# EAGLE design ButtonMatrix (EAGLE 7.6.0)
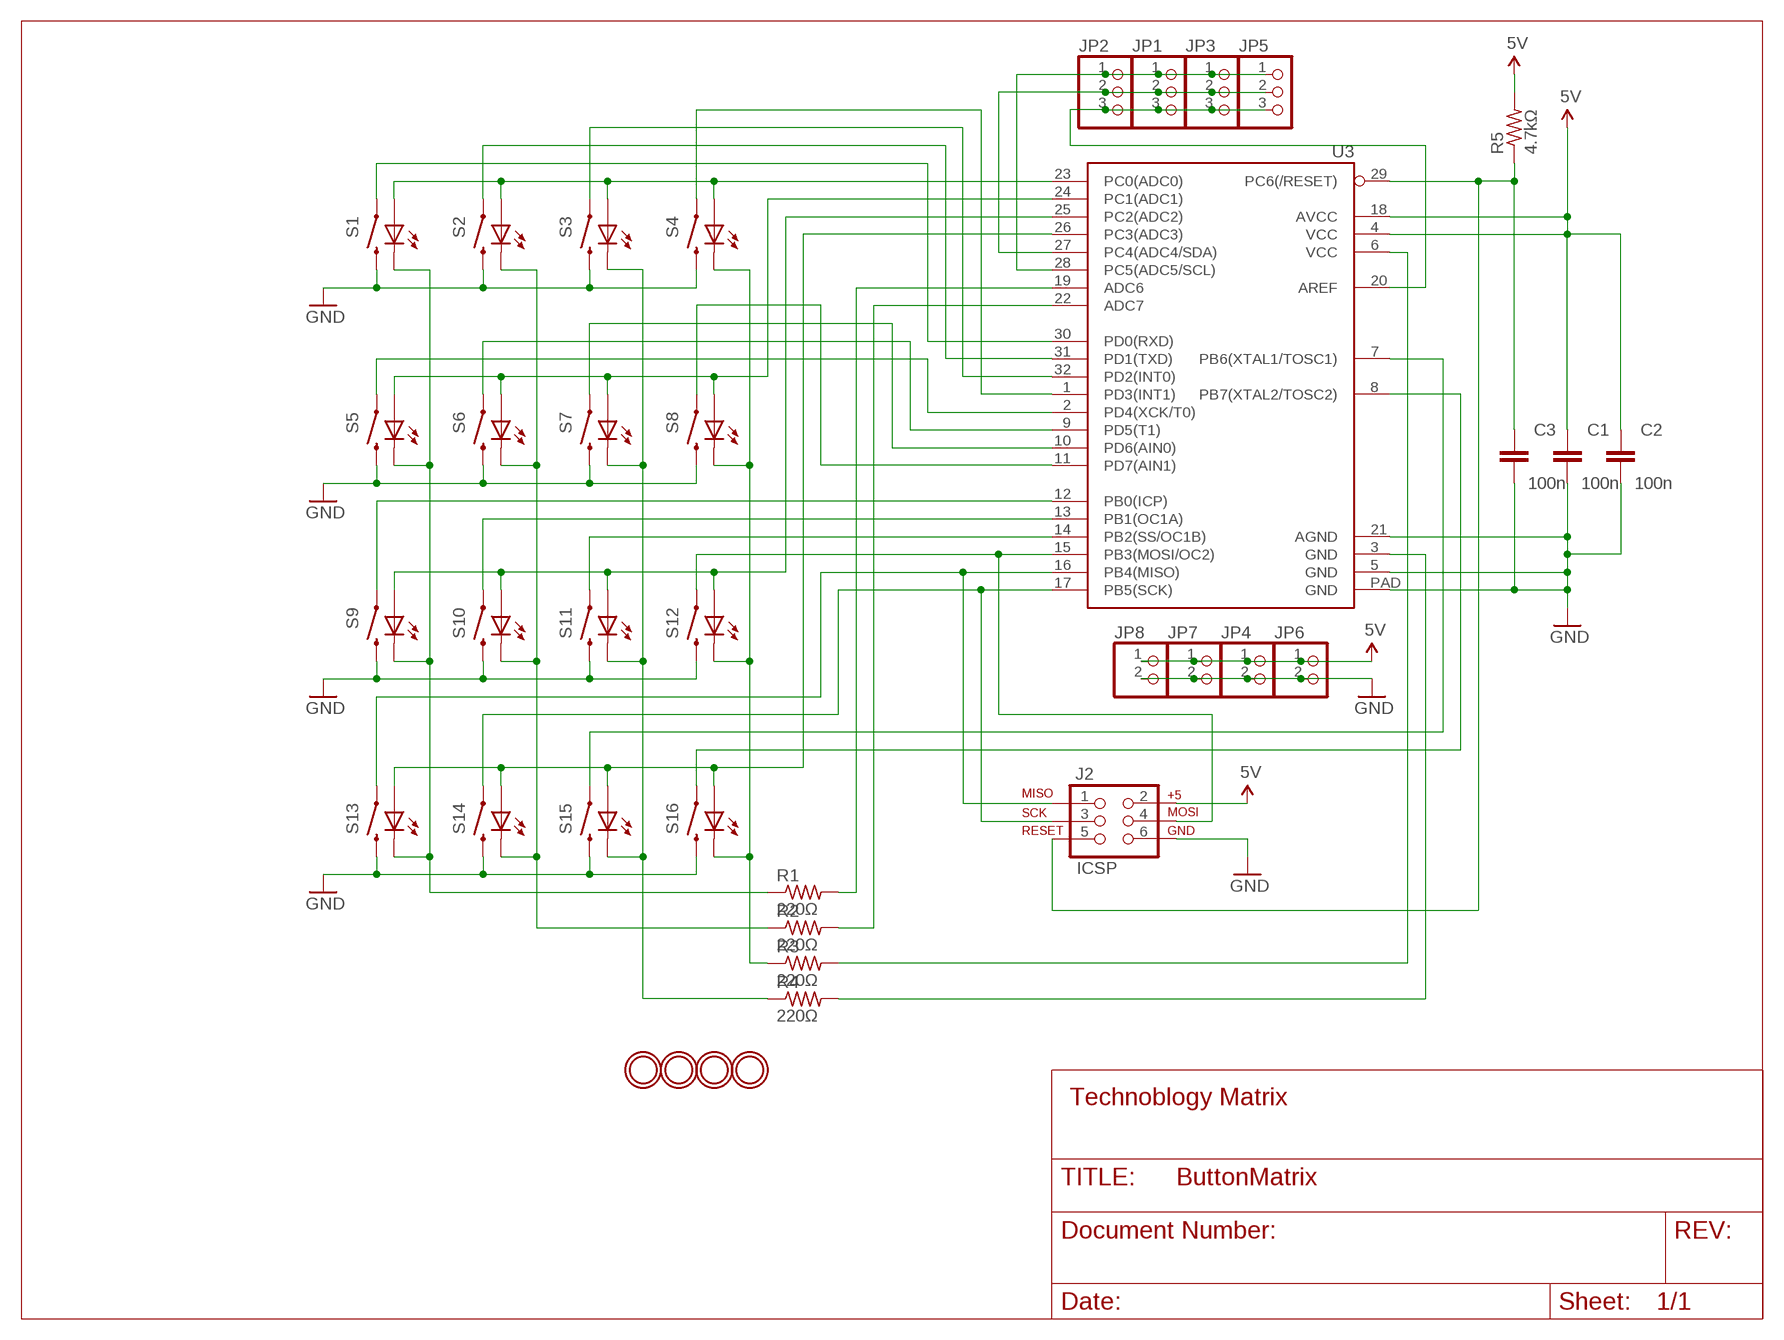
[diagram p0: schematic, sheet 1]

## Parts
C1  100n  CAP0603-CAP  [0603-CAP]
C2  100n  CAP0603-CAP  [0603-CAP]
C3  100n  CAP0603-CAP  [0603-CAP]
J2  ICSP  AVR_SPI_PRG_6PTH  [2X3]
JP1  HEADER-1X3EDGESMT  [1X03_EDGESMT]
JP2  HEADER-1X3EDGESMT  [1X03_EDGESMT]
JP3  HEADER-1X3EDGESMT  [1X03_EDGESMT]
JP4  HEADER-1X2EDGE  [1X02_EDGESMT]
JP5  HEADER-1X3EDGESMT  [1X03_EDGESMT]
JP6  HEADER-1X2EDGE  [1X02_EDGESMT]
JP7  HEADER-1X2EDGE  [1X02_EDGESMT]
JP8  HEADER-1X2EDGE  [1X02_EDGESMT]
R1  220Ω  R-US_R0805  [R0805]
R2  220Ω  R-US_R0805  [R0805]
R3  220Ω  R-US_R0805  [R0805]
R4  220Ω  R-US_R0805  [R0805]
R5  4.7kΩ  R-US_R0805  [R0805]
S1  SWITCH-MOMENTARY-LEDPTH  [TACTILE-PTH-LED-12MM]
S2  SWITCH-MOMENTARY-LEDPTH  [TACTILE-PTH-LED-12MM]
S3  SWITCH-MOMENTARY-LEDPTH  [TACTILE-PTH-LED-12MM]
S4  SWITCH-MOMENTARY-LEDPTH  [TACTILE-PTH-LED-12MM]
S5  SWITCH-MOMENTARY-LEDPTH  [TACTILE-PTH-LED-12MM]
S6  SWITCH-MOMENTARY-LEDPTH  [TACTILE-PTH-LED-12MM]
S7  SWITCH-MOMENTARY-LEDPTH  [TACTILE-PTH-LED-12MM]
S8  SWITCH-MOMENTARY-LEDPTH  [TACTILE-PTH-LED-12MM]
S9  SWITCH-MOMENTARY-LEDPTH  [TACTILE-PTH-LED-12MM]
S10  SWITCH-MOMENTARY-LEDPTH  [TACTILE-PTH-LED-12MM]
S11  SWITCH-MOMENTARY-LEDPTH  [TACTILE-PTH-LED-12MM]
S12  SWITCH-MOMENTARY-LEDPTH  [TACTILE-PTH-LED-12MM]
S13  SWITCH-MOMENTARY-LEDPTH  [TACTILE-PTH-LED-12MM]
S14  SWITCH-MOMENTARY-LEDPTH  [TACTILE-PTH-LED-12MM]
S15  SWITCH-MOMENTARY-LEDPTH  [TACTILE-PTH-LED-12MM]
S16  SWITCH-MOMENTARY-LEDPTH  [TACTILE-PTH-LED-12MM]
U3  ATMEGA328P_MLFMLF32  [MLF32-PAD]
U$1  MOUNTINGHOLE2.5  [MOUNTINGHOLE_2.5_PLATED]
U$2  MOUNTINGHOLE2.5  [MOUNTINGHOLE_2.5_PLATED]
U$3  MOUNTINGHOLE2.5  [MOUNTINGHOLE_2.5_PLATED]
U$4  MOUNTINGHOLE2.5  [MOUNTINGHOLE_2.5_PLATED]

## Nets
5V: C1.1 C2.1 J2.2 JP4.1 JP6.1 JP7.1 JP8.1 R5.2 U3.4(VCC) U3.18(AVCC)
GND: C1.2 C2.2 C3.2 J2.6 JP4.2 JP6.2 JP7.2 JP8.2 S1.2 S2.2 S3.2 S4.2 S5.2 S6.2 S7.2 S8.2 S9.2 S10.2 S11.2 S12.2 S13.2 S14.2 S15.2 S16.2 U3.5(GND) U3.21(AGND) U3.PAD(GND)
N$2: S9.A S10.A S11.A S12.A U3.25(PC2(ADC2))
N$5: R1.1 S1.C S5.C S9.C S13.C
N$6: R2.1 S2.C S6.C S10.C S14.C
N$7: R3.2 U3.6(VCC)
N$8: S1.4 U3.30(PD0(RXD))
N$9: R3.1 S4.C S8.C S12.C S16.C
N$10: S2.4 U3.31(PD1(TXD))
N$11: S3.4 U3.32(PD2(INT0))
N$12: S4.4 U3.1(PD3(INT1))
N$13: S5.4 U3.2(PD4(XCK/T0))
N$14: S6.4 U3.9(PD5(T1))
N$15: S7.4 U3.10(PD6(AIN0))
N$16: S8.4 U3.11(PD7(AIN1))
N$17: S9.4 U3.12(PB0(ICP))
N$18: S10.4 U3.13(PB1(OC1A))
N$19: S11.4 U3.14(PB2(SS/OC1B))
N$20: J2.4 S12.4 U3.15(PB3(MOSI/OC2))
N$21: J2.1 S13.4 U3.16(PB4(MISO))
N$22: J2.3 S14.4 U3.17(PB5(SCK))
N$23: S15.4 U3.7(PB6(XTAL1/TOSC1))
N$24: S16.4 U3.8(PB7(XTAL2/TOSC2))
N$25: S1.A S2.A S3.A S4.A U3.23(PC0(ADC0))
N$27: S5.A S6.A S7.A S8.A U3.24(PC1(ADC1))
N$28: S13.A S14.A S15.A S16.A U3.26(PC3(ADC3))
N$29: JP1.2 JP2.2 JP3.2 JP5.2 U3.27(PC4(ADC4/SDA))
N$30: JP1.1 JP2.1 JP3.1 JP5.1 U3.28(PC5(ADC5/SCL))
N$31: JP1.3 JP2.3 JP3.3 JP5.3 U3.20(AREF)
N$32: R2.2 U3.22(ADC7)
N$33: R1.2 U3.19(ADC6)
N$34: C3.1 J2.5 R5.1 U3.29(PC6(/RESET))
N$35: R4.2 U3.3(GND)
N$36: R4.1 S3.C S7.C S11.C S15.C

## Notes on the sheet
- Technoblogy Matrix

## Library data of the parts
C1-C3 = SparkFun-Capacitors:CAP: Capacitor Standard 0603 ceramic capacitor, and 0.1" leaded capacitor.
J2 = SparkFun:AVR_SPI_PRG_6: AVR ISP 6 Pin This is the reduced ISP connector for AVR programming. Common on Arduino. This footprint will take up less PCB space and can be used with a 10-pin to 6-pin adapter such as SKU: BOB-08508
JP1-JP3 JP5 = microbuilder:HEADER-1X3: PIN HEADER
JP4 JP6-JP8 = microbuilder:HEADER-1X2: PIN HEADER
R1-R5 = adafruit:R-US_: RESISTOR, American symbol
S1-S16 = SparkFun-Electromechanical:SWITCH-MOMENTARY-LED: EZ is for Kits. There is no tStop (covering up the top side of the pads with mask). This helps the beginner see which side they should be soldering too.
U3 = SparkFun-DigitalIC:ATMEGA328P_MLF: 32-Pin Atmega328 part Commonly used on Arduino compatible boards Available in QFP and QFN packages TQFP is IC-09069 QFN is non-stock
U$1-U$4 = microbuilder:MOUNTINGHOLE: Mounting Hole For #2 screws (0.086"/2.18mm width, 0.094"/2.4mm hole) use 2.5mm; BOM: EXCLUDE

## Board
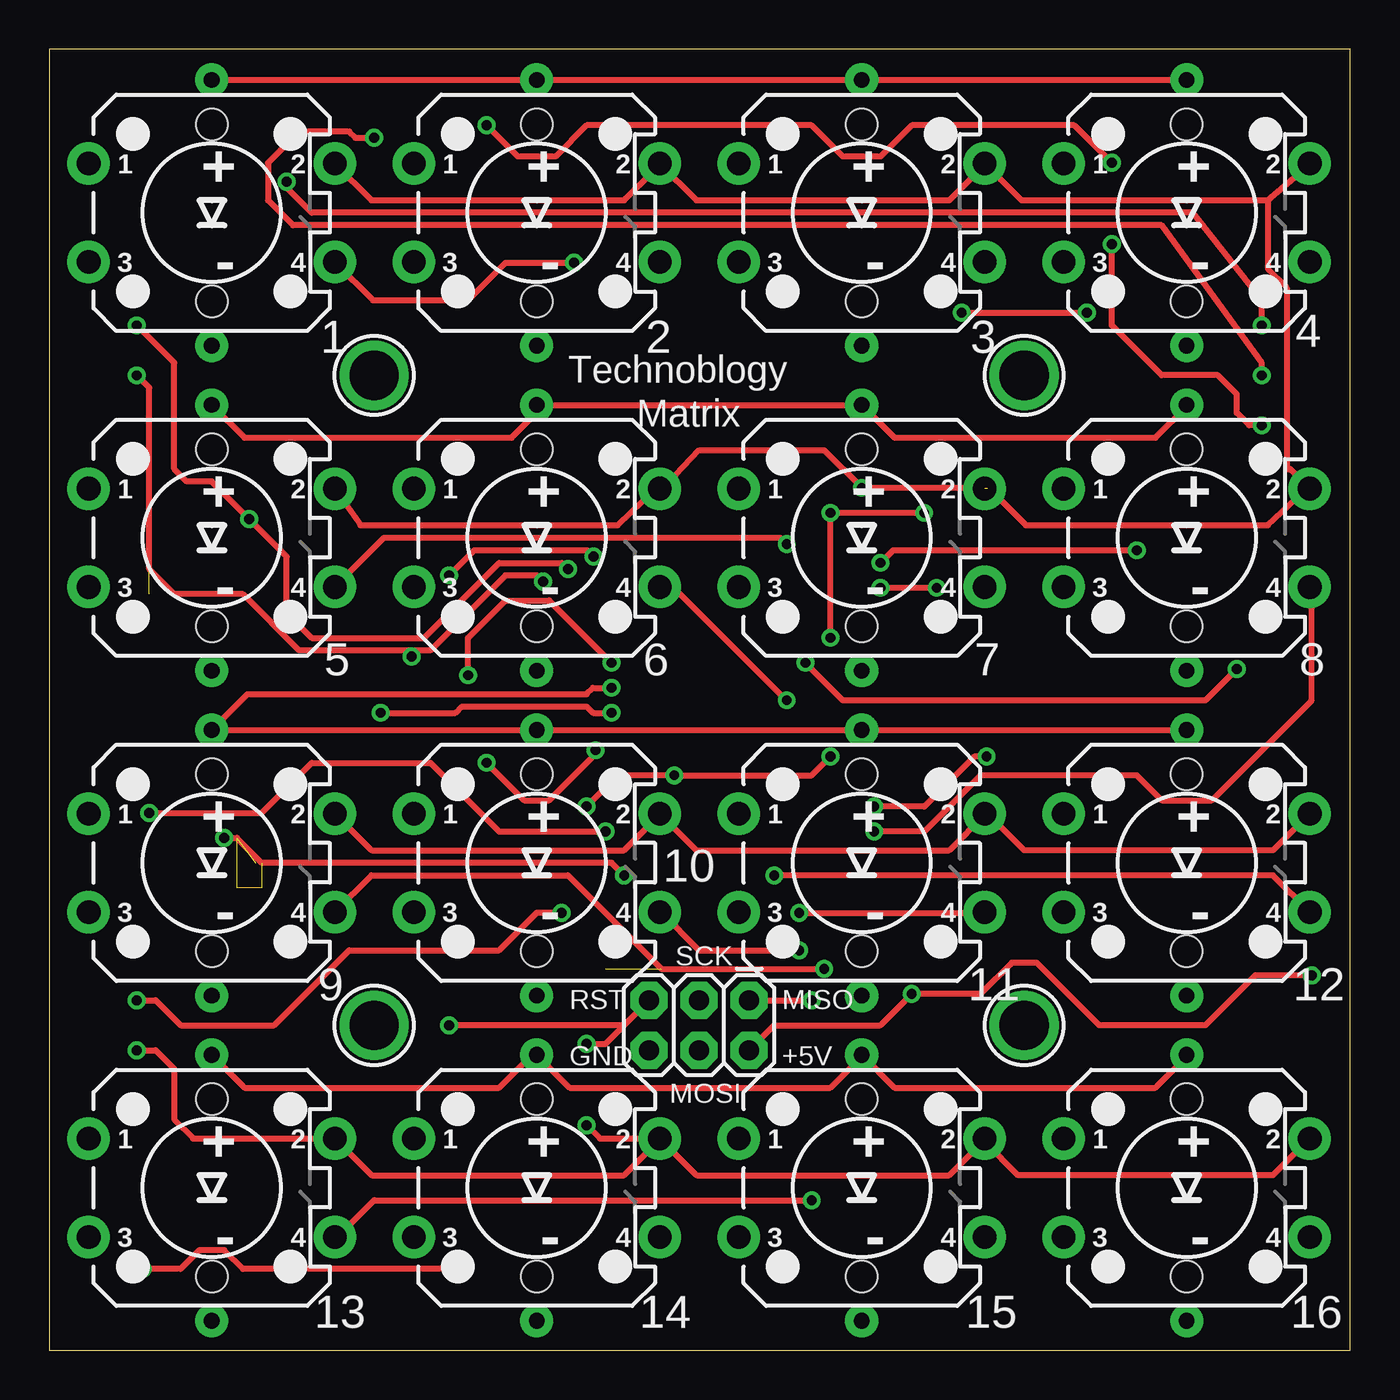
[diagram p1: board, top side]
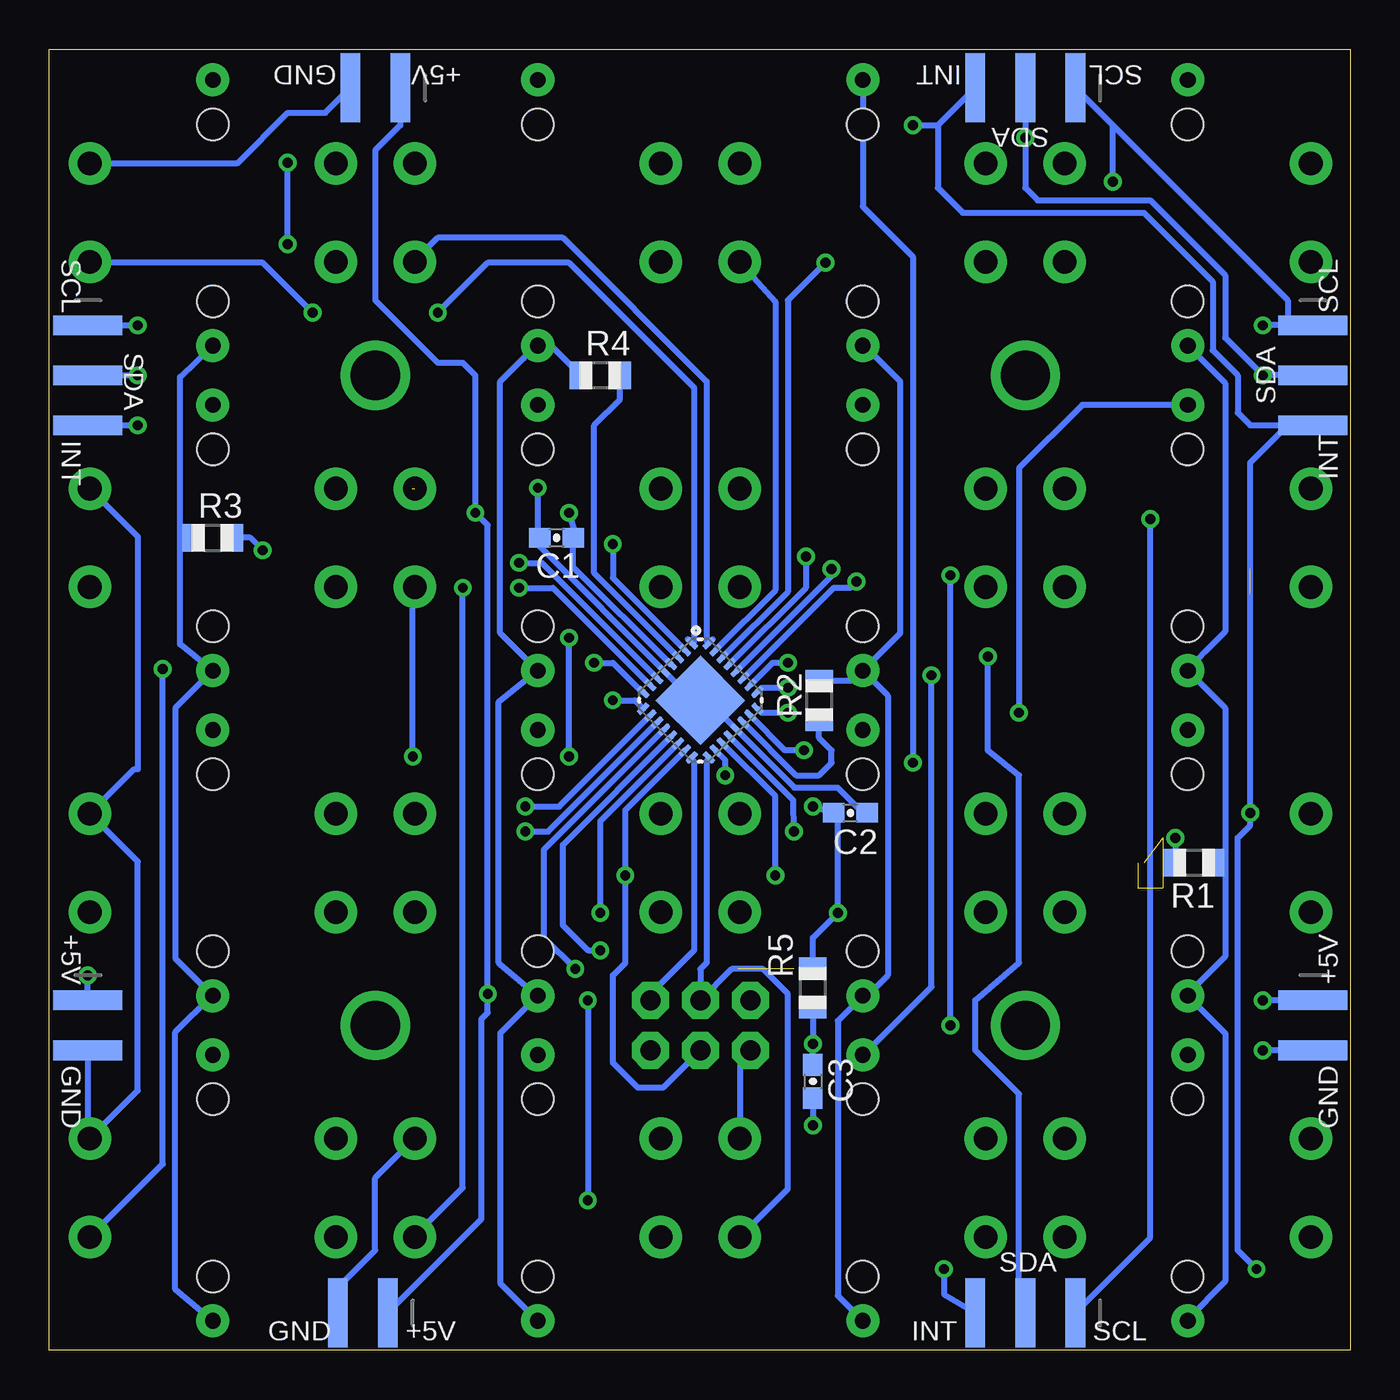
[diagram p2: board, bottom side, seen from below]

Size 66.1 x 66.1 mm. Coordinates in mm from the lower left corner, seen from the top.
Outline: 0,0 66.1,0 66.1,66.1 0,66.1 0,0
Copper layers (1*16): Top 0.035mm / dielectric 1.5mm / Bottom 0.035mm
Design rules "adafruit *": minimum track width 8mil, minimum drill 15.5mil, track to track 6mil, track to pad 6mil, pad to pad 6mil, via to via 6mil, smd to smd 6mil, copper to edge 10mil, drill to drill 8mil, minimum pad ring 10mil, minimum via ring 8mil, stop-mask expansion 4mil, vias tented up to drill 20mil, thermal gap 10mil

### Footprints (pad centres in the part's own frame; a part is rotated, then mirrored left to right if it is on the bottom)
0603-CAP = smd 1.1 x 1: 1 -0.85,0; 2 0.85,0
2X3 = drill 1.016 pad 1.88 octagon: 1 0,0; 2 0,2.54; 3 2.54,0; 4 2.54,2.54; 5 5.08,0; 6 5.08,2.54
1X03_EDGESMT = smd 1 x 3.5: 1 -2.54,0; 2 0,0; 3 2.54,0
1X02_EDGESMT = smd 1 x 3.5: 1 -1.27,0; 2 1.27,0
R0805 = smd 1.1 x 1.4: 1 -1,0; 2 1,0
TACTILE-PTH-LED-12MM = drill 1.2 pad 2.159: 1 -6.25,2.5; 2 6.25,2.5; 3 -6.25,-2.5; 4 6.25,-2.5 | drill 0.8 pad 1.676: A 0,6.75; C 0,-6.75 | hole 1.6: 0,4.5; 0,-4.5
MLF32-PAD = smd 0.7 x 0.3: 1 -2.35,1.75; 2 -2.35,1.25; 3 -2.35,0.75; 4 -2.35,0.25; 5 -2.35,-0.25; 6 -2.35,-0.75; 7 -2.35,-1.25; 8 -2.35,-1.75; 17 2.35,-1.75; 18 2.35,-1.25; 19 2.35,-0.75; 20 2.35,-0.25; 21 2.35,0.25; 22 2.35,0.75; 23 2.35,1.25; 24 2.35,1.75 | smd 0.3 x 0.7: 9 -1.75,-2.35; 10 -1.25,-2.35; 11 -0.75,-2.35; 12 -0.25,-2.35; 13 0.25,-2.35; 14 0.75,-2.35; 15 1.25,-2.35; 16 1.75,-2.35; 25 1.75,2.35; 26 1.25,2.35; 27 0.75,2.35; 28 0.25,2.35; 29 -0.25,2.35; 30 -0.75,2.35; 31 -1.25,2.35; 32 -1.75,2.35 | smd 3.2 x 3.2: PAD 0,0
MOUNTINGHOLE_2.5_PLATED = drill 2.5 pad 3.2: P$1 0,0

### Placement (x,y rotation side)
C1  40.32,41.27 180 bottom
C2  25.4,27.3 0 bottom
C3  27.3,13.65 270 bottom
J2  35.56,17.78 180 top
JP1  64.13,49.53 270 bottom
JP2  1.91,49.53 270 bottom
JP3  16.51,64.13 180 bottom
JP4  1.91,16.51 270 bottom
JP5  16.51,1.91 180 bottom
JP6  64.13,16.51 270 bottom
JP7  50.16,1.91 180 bottom
JP8  49.53,64.13 180 bottom
R1  7.94,24.76 180 bottom
R2  26.99,33.02 270 bottom
R3  57.79,41.27 0 bottom
R4  38.1,49.53 0 bottom
R5  27.3,18.41 90 bottom
S1  8.26,57.79 0 top
S2  24.76,57.79 0 top
S3  41.27,57.79 0 top
S4  57.79,57.79 0 top
S5  8.26,41.27 0 top
S6  24.76,41.27 0 top
S7  41.27,41.27 0 top
S8  57.79,41.27 0 top
S9  8.26,24.76 0 top
S10  24.76,24.76 0 top
S11  41.27,24.76 0 top
S12  57.79,24.76 0 top
S13  8.26,8.26 0 top
S14  24.76,8.26 0 top
S15  41.27,8.26 0 top
S16  57.79,8.26 0 top
U3  33.02,33.02 315 bottom
U$1  16.51,49.53 0 top
U$2  49.53,16.51 0 top
U$3  49.53,49.53 0 top
U$4  16.51,16.51 0 top

### Tracks (layer width: path | path; a pad name or v marks a point on that pad's centre or on a via)
5V  (via drill 0.5)
  Top 0.305: J2.2 36.83,16.51 42.23,16.51 v43.82,18.1 47.31,18.1 48.9,19.68 50.16,19.68 53.34,16.51 58.74,16.51 61.28,19.05 v64.13,19.05 | v44.45,42.55 v39.69,42.55 v39.69,36.2 | v39.69,30.16 38.73,29.21 v31.75,29.21 28.89,29.21 v27.3,27.62 | v4.45,17.78 5.4,17.78 6.67,16.51 11.43,16.51 15.24,20.32 22.86,20.32 24.76,22.22 v26.04,22.22
  Bottom 0.305: U3.4 34.54,34.86 39.47,39.79 C1.1 39.37,41.38 v39.69,42.55 | JP6.1 v64.13,19.05 | JP4.1 v4.45,17.78 | JP7.1 44.13,6.67 44.13,16.83 43.82,17.14 v43.82,18.1 43.82,41.91 v44.45,42.55 44.45,49.53 45.09,50.16 46.36,50.16 49.53,53.34 49.53,60.96 48.26,62.23 JP8.1 | v39.69,30.16 v39.69,36.2 | v31.75,29.21 31.75,29.98 U3.18 | v27.3,27.62 27.2,27.62 C2.1 26.04,27.09 v26.04,22.22 27.3,20.95 R5.2
GND  (via drill 0.5)  (1 unrouted)
  Top 0.305: S9.2 16.37,25.4 29.21,25.4 31.07,27.26 S10.2 32.88,25.4 45.72,25.4 47.59,27.26 | S12.2 62.17,25.4 49.53,25.4 47.66,27.26 47.59,27.26 | 47.59,27.26 S11.2 | S14.2 31.07,10.76 29.21,8.89 16.37,8.89 S13.2 7.3,10.76 6.35,11.71 6.35,14.29 5.4,15.24 v4.45,15.24 | S14.2 32.88,8.89 45.72,8.89 47.52,10.7 S15.2 | S16.2 62.17,8.89 49.21,8.89 47.52,10.58 S15.2 | 31.07,43.77 S6.2 | S1.2 16.37,58.42 29.21,58.42 30.7,59.91 S2.2 32.88,58.42 45.72,58.42 47.52,60.23 S3.2 49.39,58.42 61.91,58.42 | 61.91,58.42 64.09,60.29 S4.2 | 47.48,10.79 S15.2 | S5.2 15.81,41.91 28.89,41.91 30.84,43.77 S6.2 | S6.2 31.01,43.6 33.02,45.72 39.37,45.72 v41.27,43.82 47.48,43.82 S7.2 | 48.34,43.18 49.61,41.91 61.91,41.91 64.03,43.91 S8.2 63.04,44.77 62.87,44.77 62.87,53.98 61.91,54.93 61.91,58.42 | 48.34,43.18 47.75,43.77 47.66,43.77 48.34,43.18 | v27.3,11.43 27.98,10.76 S14.2
  Bottom 0.305: S8.2 61.59,41.34 61.59,29.53 61.77,29.53 S12.2 61.59,24.82 61.59,13.2 S16.2 64.13,10.86 JP6.2 | J2.6 31.01,14.71 S14.2 | JP4.2 v4.45,15.24 | JP7.2 51.44,3.17 49.53,5.08 49.53,8.75 S15.2 | S4.2 56.55,60.29 53.98,62.87 52.07,62.87 JP8.2 | C2.2 24.76,27.3 26.04,28.57 28.26,28.57 28.26,28.61 U3.21 32.67,33.02 U3.PAD 33.37,33.02 U3.5 41.17,40.82 C1.2 41.27,41.38 v41.27,43.82 | C3.2 v27.3,11.43
N$2  (via drill 0.5)
  Top 0.305: v28.57,33.66 27.62,33.66 27.3,33.34 10.08,33.34 S9.A | S9.A S10.A S11.A | S11.A S12.A | 41.27,31.43 S11.A | 9.12,32.39 S9.A
  Bottom 0.305: v28.57,33.66 29.91,33.66 U3.25 | 8.29,31.51 S9.A
N$5
  Bottom 0.305: 6.35,24.76 6.35,32.62 S5.C 7.38,35.48 6.35,36.51 6.35,49.13 S1.C | 6.35,24.76 6.35,20 8.02,18.33 S9.C 6.35,16.11 6.35,3.49 8.26,1.59 S13.C | R1.1 6.35,24.76
N$6
  Bottom 0.305: S14.C 26.04,2.78 26.04,16.74 S10.C 24.53,18.01 23.49,19.05 23.49,33.26 S6.C | S6.C 22.86,36.43 22.86,49.21 24.68,51.04 S2.C | 23.76,35.52 S6.C | R2.1 25.27,34.02 S6.C
N$7  (via drill 0.5)
  Top 0.305: v42.23,40.01 42.86,40.64 v55.25,40.64
  Bottom 0.305: v42.23,40.01 41.07,40.01 U3.6 | v55.25,40.64 55.88,41.27 R3.2
N$8  (via drill 0.5)
  Top 0.305: S1.4 16.45,53.34 21.27,53.34 23.18,55.25 v26.67,55.25
  Bottom 0.305: U3.30 28.57,38.53 28.57,53.34 v26.67,55.25
N$9
  Bottom 0.305: S16.C 59.69,3.09 59.69,16.17 57.84,18.01 S12.C 59.69,19.92 59.69,32.62 S8.C 59.46,35.88 59.46,41.27 | S4.C 59.46,49.45 59.46,41.27 | R3.1 59.46,41.27
N$10
  Bottom 0.305: S2.4 29.21,53.28 29.21,38.6 U3.31
N$11
  Bottom 0.305: 32.39,36.13 U3.32 32.7,36.03 32.7,49.21 40.01,56.52 46.36,56.52 47.52,55.34 S3.4
N$12  (via drill 0.5)
  Top 0.305: v46.36,52.71 v52.71,52.71
  Bottom 0.305: 33.66,36.13 U3.1 33.34,36.03 33.34,48.9 39.69,55.25 43.82,55.25 v46.36,52.71 | v52.71,52.71 55.25,55.25 63.99,55.25 S4.4
N$13  (via drill 0.5)
  Top 0.305: S5.4 17,41.27 37.15,41.27 v37.47,40.96
  Bottom 0.305: v37.47,40.96 37.47,39.23 U3.2
N$14  (via drill 0.5)
  Top 0.305: S6.4 31.65,38.84 v37.47,33.02
  Bottom 0.305: v37.47,33.02 36.34,33.02 U3.9
N$15  (via drill 0.5)
  Top 0.305: v47.62,30.16 46.99,30.16 44.45,27.62 v41.91,27.62
  Bottom 0.305: v41.91,27.62 40.19,27.62 U3.10 | v47.62,30.16 47.62,38.68 S7.4
N$16  (via drill 0.5)
  Top 0.305: v41.91,26.35 44.45,26.35 47.31,29.21 55.25,29.21 56.52,27.94 59.05,27.94 64.13,33.02 64.13,38.68 S8.4
  Bottom 0.305: U3.11 40.75,26.35 v41.91,26.35
N$17  (via drill 0.5)  (1 unrouted)
  Top 0.305: S9.4 16.37,24.13 26.35,24.13 31.11,19.37 v39.37,19.37
  Bottom 0.305: v39.37,19.37 40.96,20.95 40.96,25.44 U3.12
N$18  (via drill 0.5)
  Top 0.305: S10.4 31.07,22.26 33.02,20.32 v38.1,20.32
  Bottom 0.305: U3.13 40.01,25.68 40.01,21.59 38.73,20.32 v38.1,20.32
N$19  (via drill 0.5)
  Top 0.305: v38.1,22.22 47.48,22.22 S11.4
  Bottom 0.305: v38.1,22.22 38.1,26.88 U3.14
N$20  (via drill 0.5)
  Top 0.305: S12.4 62.17,24.13 v36.83,24.13
  Bottom 0.305: U3.15 36.83,27.44 v36.83,24.13 36.83,19.68 37.47,19.05 37.47,14.61 36.2,13.34 34.93,13.34 J2.4
N$21  (via drill 0.5)
  Top 0.305: S13.4 14.64,5.75 16.51,7.62 v38.73,7.62 | J2.1 v38.73,17.78
  Bottom 0.305: U3.16 33.34,29.91 33.34,20.32 35.56,18.1 J2.1 | v38.73,17.78 v38.73,7.62
N$22
  Bottom 0.305: U3.17 32.7,29.91 32.7,19.68 33.02,19.37 J2.3 31.43,19.37 29.84,19.37 28.57,18.1 28.57,8.2 S14.4
N$23  (via drill 0.5)
  Top 0.305: v45.09,38.73 v42.23,38.73
  Bottom 0.305: S15.4 47.52,5.82 45.09,8.26 v45.09,38.73 | v42.23,38.73 40.5,38.73 U3.7
N$24  (via drill 0.5)
  Top 0.305: v60.33,34.61 58.74,33.02 40.32,33.02 v38.42,34.93
  Bottom 0.305: S16.4 60.33,9.46 v60.33,34.61 | v38.42,34.93 37.47,34.93 35.98,33.44 U3.8
N$25  (via drill 0.5)
  Top 0.305: v22.22,29.84 24.13,27.94 25.4,27.94 27.76,30.3 v27.76,30.48 | S1.A S2.A S3.A S4.A
  Bottom 0.305: v22.22,29.84 22.22,55.56 24.76,58.1 S2.A | v27.76,30.48 28.71,30.48 U3.23 | S1.A 8.44,64.53
N$27  (via drill 0.5)
  Top 0.305: v16.83,32.39 20.64,32.39 20.95,32.7 27.3,32.7 27.62,32.39 v28.57,32.39 | S5.A 9.93,46.36 23.49,46.36 24.76,47.62 S6.A S7.A 42.95,46.36 56.2,46.36 57.79,47.94 S8.A
  Bottom 0.305: v16.83,32.39 16.83,44.82 13.62,48.02 S5.A | v28.57,32.39 29.91,32.39 U3.24
N$28  (via drill 0.5)
  Top 0.305: v21.27,34.29 21.27,36.2 23.18,38.1 25.4,38.1 v28.57,34.93 | S16.A 57.79,14.92 56.2,13.34 42.95,13.34 S15.A 40.96,14.61 39.69,13.34 26.43,13.34 S14.A 24.53,15.01 22.86,13.34 9.93,13.34 S13.A
  Bottom 0.305: v21.27,34.29 21.27,18.46 24.73,15.01 S14.A 24.26,15.51 | v28.57,34.93 29.35,34.93 U3.26
N$29  (via drill 0.5)  (1 unrouted)
  Top 0.305: v25.08,39.05 24.76,39.37 23.18,39.37 19.37,35.56 18.41,35.56 | 18.41,35.56 12.7,35.56 9.84,38.42 6.35,38.42 5.08,39.69 5.08,48.9 v4.45,49.53 | v61.59,49.53 61.59,50.16 56.52,57.15 12.38,57.15 11.11,58.42 11.11,60.33 12.7,61.91 15.24,61.91 15.56,61.59 v16.51,61.59 | v18.41,35.24 18.41,35.56
  Bottom 0.305: JP2.2 v4.45,49.53 6.35,51.44 6.35,54.61 10.16,58.42 15.88,58.42 16.51,59.05 v16.51,61.59 JP3.2 | v25.08,39.05 25.4,38.73 26.24,38.73 U3.27 | JP1.2 v61.59,49.53 | JP5.2 16.83,2.22 16.83,13.02 19.05,15.24 19.05,17.78 16.83,19.68 16.83,29.21 18.41,30.48 v18.41,35.24
N$30  (via drill 0.5)
  Top 0.305: v26.35,39.69 26.04,40.01 22.86,40.01 19.05,36.2 13.34,36.2 12.06,37.47 12.06,40.32 v10.16,42.23 8.26,44.13 6.99,44.13 6.35,44.77 6.35,50.16 v4.45,52.07 | v61.59,52.07 61.59,53.34 58.1,57.79 13.34,57.79 12.06,59.05 v12.06,59.37
  Bottom 0.305: JP2.1 3.17,52.07 | 3.17,52.07 v4.45,52.07 | v26.35,39.69 26.35,39.33 U3.28 | JP1.1 v61.59,52.07 | 3.17,52.07 3.17,53.34 JP3.1 12.06,62.23 v12.06,59.37 | JP5.1 10.16,5.71 v10.16,42.23
N$31  (via drill 0.5)
  Top 0.305: v5.08,27.3 10.79,27.3 13.34,29.84 19.37,29.84 22.86,26.35 v28.26,26.35 | v61.59,46.99 60.96,46.99 60.33,47.62 60.33,48.58 59.37,49.53 56.52,49.53 53.98,52.07 v53.98,56.2 | v53.98,60.33 52.07,62.23 43.82,62.23 42.23,60.64 40.32,60.64 38.73,62.23 27.3,62.23 25.72,60.64 23.81,60.64 v22.22,62.23 | v20.64,4.13 9.84,4.13 8.89,5.08 7.62,5.08 6.67,4.13 v4.76,4.13
  Bottom 0.305: v28.26,26.35 28.29,27.94 U3.20 | v4.76,4.13 5.71,5.08 5.71,26.04 5.08,26.67 v5.08,27.3 5.08,45.09 3.17,46.99 | 20.95,62.23 20.95,59.05 19.68,57.79 10.48,57.79 6.99,54.29 6.99,50.8 5.71,49.53 5.71,47.62 5.08,46.99 3.17,46.99 | 3.17,46.99 2.54,46.99 JP2.3 | JP1.3 v61.59,46.99 | v53.98,56.2 v53.98,60.33 | v22.22,62.23 20.95,62.23 | 20.95,62.23 JP3.3 | 19.05,2.54 JP5.3 20.64,2.86 v20.64,4.13
N$32
  Bottom 0.305: U3.22 28.15,29.21 26.99,29.21 26.35,29.84 26.35,30.48 26.99,31.11 R2.2
N$33  (via drill 0.5)  (5 unrouted)
  Top 0.305: v8.89,26.04 9.53,26.04 10.79,24.76 28.57,24.76 v29.21,24.13
  Bottom 0.305: U3.19 29.21,28.15 v29.21,24.13 | v8.89,26.04 8.89,24.81 R1.2
N$34  (via drill 0.5)
  Top 0.305: v20.32,39.37 21.59,40.64 27.34,40.64 v27.66,40.32 | v20.32,16.51 29.21,16.51 J2.5 28.26,15.56 v27.3,15.56
  Bottom 0.305: v20.32,16.51 v20.32,39.37 | v27.66,40.32 27.66,38.73 U3.29 | R5.1 v27.3,15.56 C3.1
N$35
  Bottom 0.305: U3.3 38.42,39.48 38.42,46.99 37.1,48.31 R4.2
N$36
  Bottom 0.305: S15.C 43.18,3.41 43.18,16.11 S11.C 43.18,19.6 43.26,19.68 43.26,32.94 S7.C 43.18,36.43 43.18,49.21 41.99,50.4 S3.C 40.61,51.04 R4.1

### Text on the board
tPlace: 4 | 1 | 2 | 3 | Technoblogy | Matrix | 5 | 6 | 7 | 8 | 10 | SCK | 9 | RST | MISO | 11 | 12 | GND | +5V | MOSI | 13 | 14 | 15 | 16
bPlace: SCL | INT | +5V | GND | SDA | SCL | SCL | SDA | SDA | INT | INT | +5V | +5V | GND | GND | SDA | SCL | INT | +5V | GND